# EasyEDA Pro project CALU_BMS_V1.3.0.0.epro, board PCB4
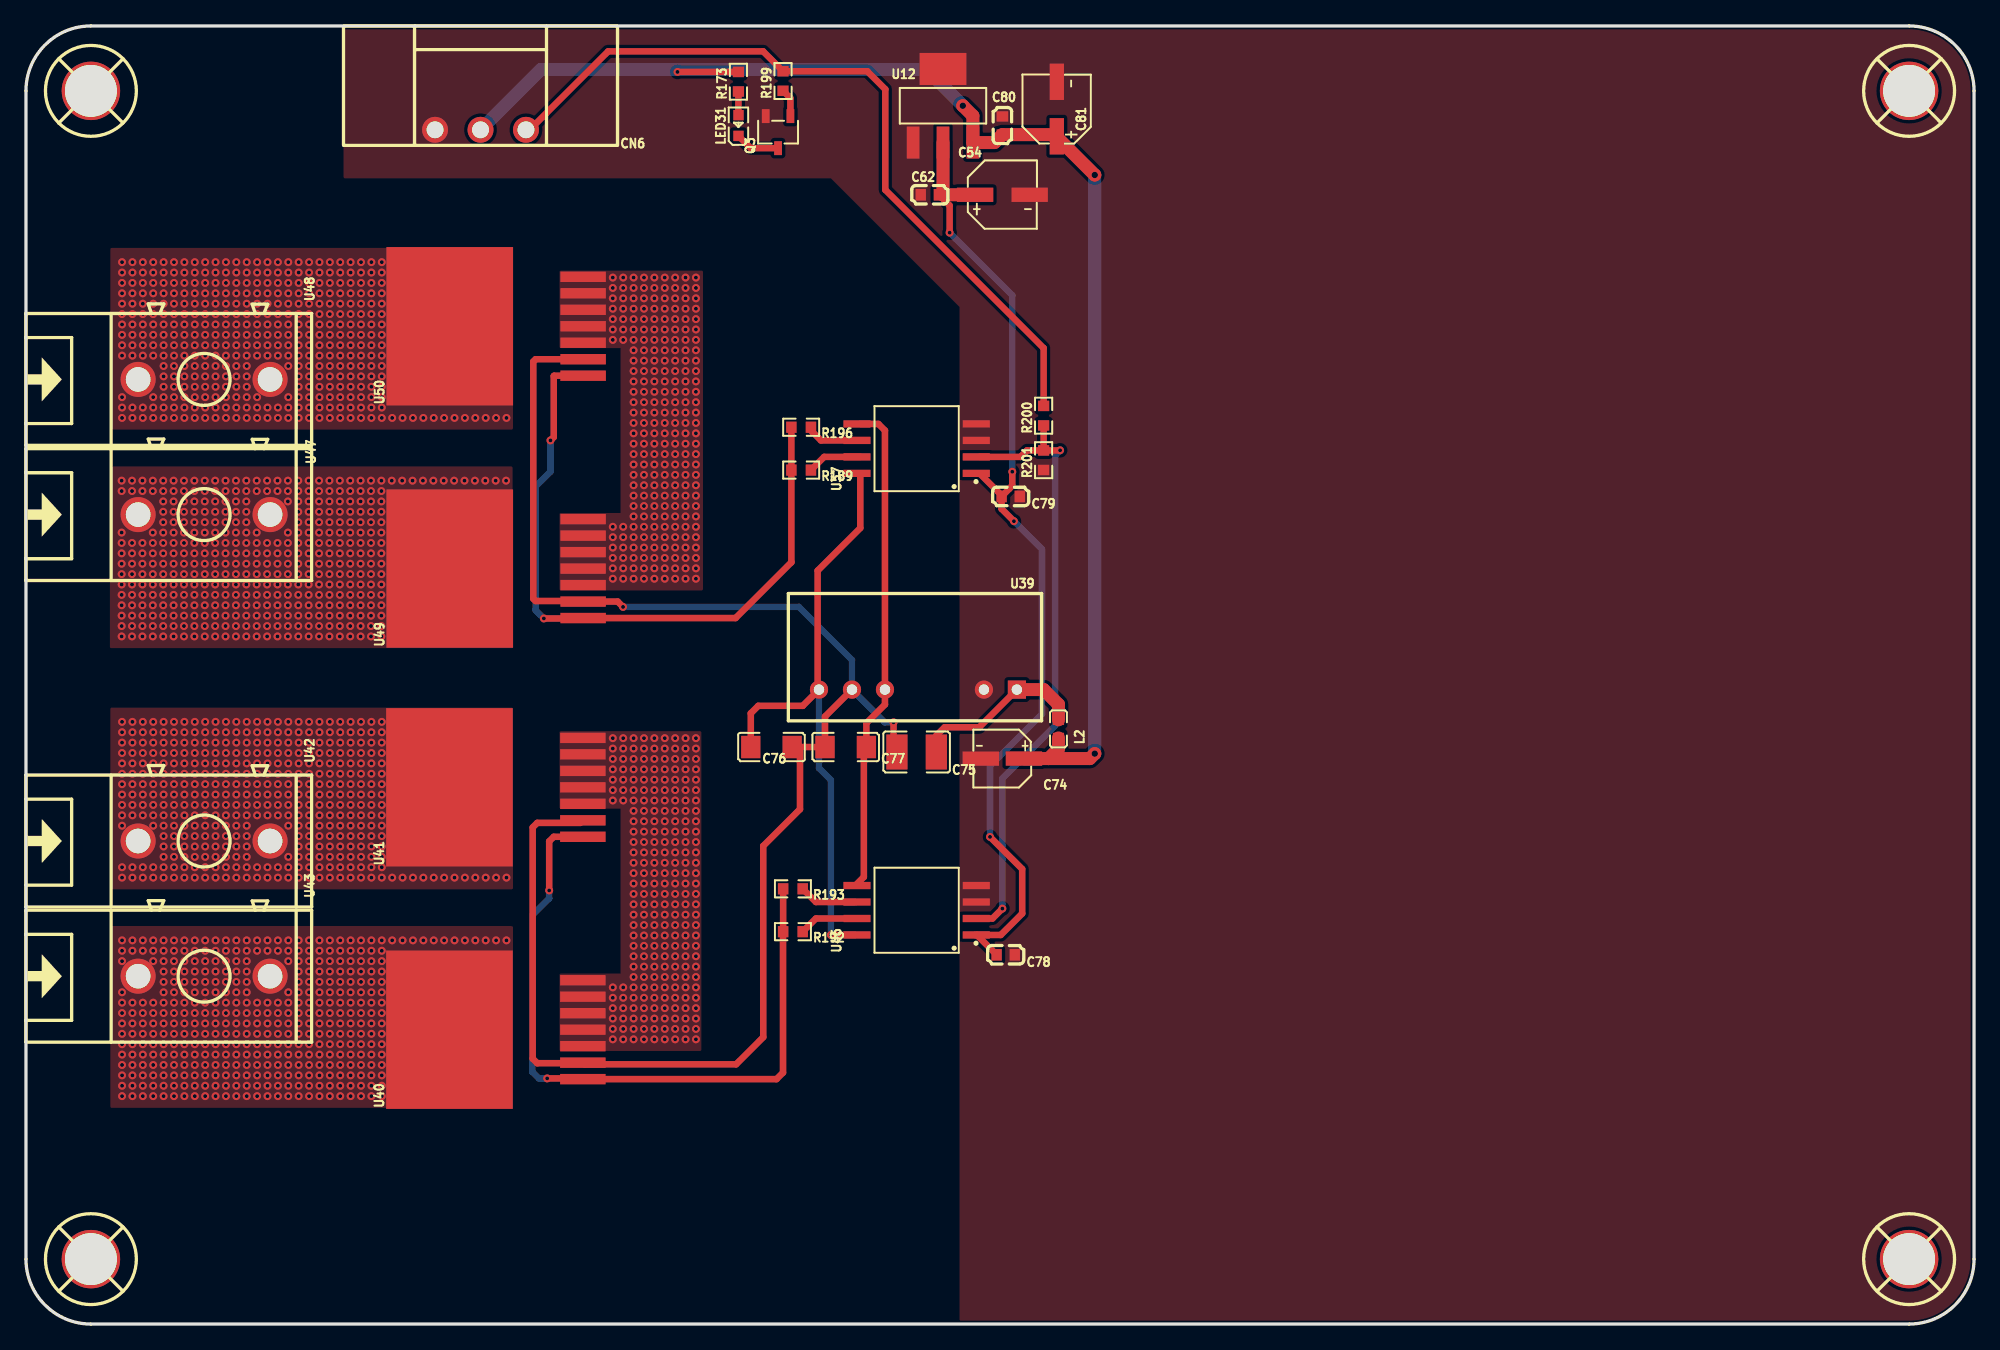
[diagram p15: board, top side]
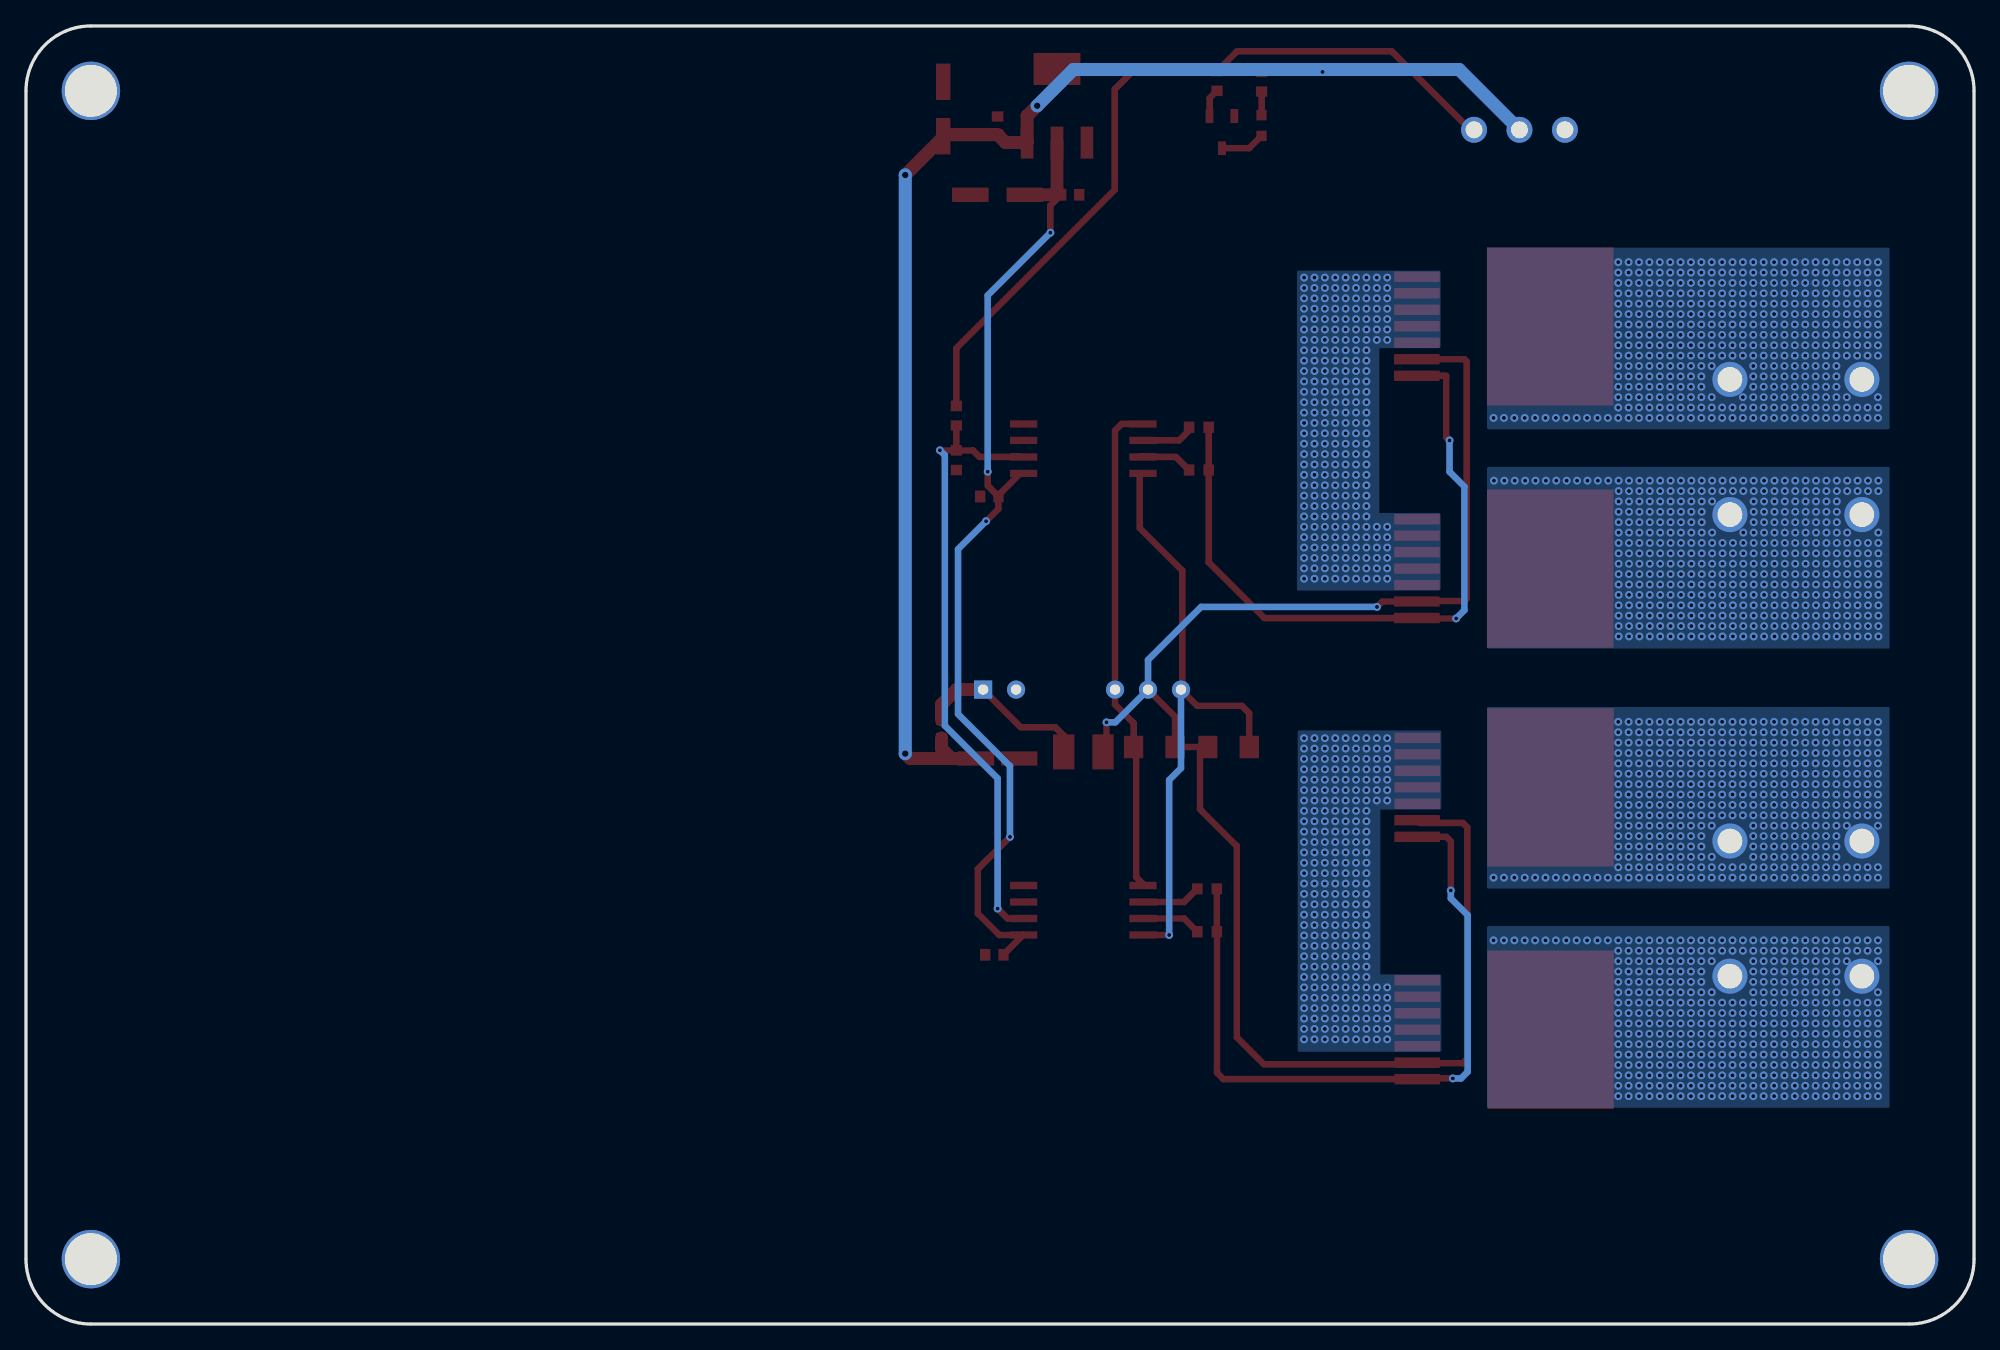
[diagram p16: board, bottom side, seen from below]

Outline 150 x 100 mm; copper layers: Top Layer, Bottom Layer. Coordinates in mm from the lower left corner of the outline.
Outline path: 0,95 0,5 arc(1.46,1.46) 5,0 145,0 arc(148.54,1.46) 150,5 150,95 arc(148.54,98.54) 145,100 5,100 arc(1.46,98.54) 0,95
Stack: Top Layer 0.035mm / Dielectric1 1.51mm FR4 er 4.5 / Bottom Layer 0.035mm

## Design rules (mm)
template: Custom Config
spacing copperThickness1oz (default): track to track 0.102, other pairs 0.152 to 0.3
spacing copperThickness2oz: track to track 0.203, other pairs 0.152 to 0.3
track width copperThickness1oz (default): min 0.127, default 0.254, max 2.54
track width copperThickness2oz: min 0.203, default 0.254, max 2.54
differential pair differentialPair (default): width min 0.127, default 0.254, max 2.54; gap min 0.152, default 0.152
via viaSize (default): diameter min 0.5, default 0.61, max 10; hole min 0.3, default 0.305, max 6.3

## Placement (name value [footprint] x y rotation side)
C54  22uF  [CAP-SMD_BD5.0-L5.3-W5.3-LS6.0-FD]  75.18 87 0 top
C62  100nF  [C0603]  69.6 87 0 top
C74  10uF  [CAP-SMD_BD4.0-L4.3-W4.3-FD]  75.18 43.56 180 top
C75  470pF  [C1210]  68.58 44.07 180 top
C76  4.7uF  [C1206]  57.4 44.45 180 top
C77  4.7uF  [C1206]  63.12 44.45 180 top
C78  100nF  [C0603]  75.44 28.45 180 top
C79  100nF  [C0603]  75.82 63.75 180 top
C80  100nF  [C0603]  75.18 92.33 270 top
C81  22uF  [CAP-SMD_BD5.0-L5.3-W5.3-LS6.0-FD]  79.38 93.6 90 top
CN6  INPUT  [CONN-TH_3P-P3.50_MAX_MX15EDGRM-3.5-GN01-03P-CU-A]  35 92 180 top
L2  10uH  [L0603]  79.5 45.85 90 top
LED31  ORH-B36G  [LED0603-RD]  54.86 92.33 90 top
Q3  S8050  [SOT-23-3_L2.9-W1.6-P1.90-LS2.8-BR]  57.91 91.82 90 top
R173  4.7kΩ  [R0603]  54.86 95.7 90 top
R189  10Ω  [R0603]  59.69 65.79 180 top
R192  10Ω  [R0603]  59.06 30.23 180 top
R193  10Ω  [R0603]  59.06 33.53 180 top
R196  10Ω  [R0603]  59.69 69.09 180 top
R199  10kΩ  [R0603]  58.29 95.76 90 top
R200  1kΩ  [R0603]  78.36 69.98 90 top
R201  2.7kΩ  [R0603]  78.36 66.55 90 top
SCREW1  -  [Screw-Hole-M4]  5 5 0 top
SCREW2  -  [Screw-Hole-M4]  145 5 0 top
SCREW3  -  [Screw-Hole-M4]  145 95 0 top
SCREW4  -  [Screw-Hole-M4]  5 95 0 top
U12  AMS1117-3.3  [SOT-223-4_L6.5-W3.5-P2.30-LS7.0-BR]  70.61 93.85 270 top
U37  1ED3121MU12H  [PG-DSO-8_L7.5-W6.4-P1.27-LS10.3-BL]  68.58 67.44 90 top
U39  50kHz  [PWRM-TH_5P-L19.5-W9.8_YLPTEC_RXXP2XX]  68.68 48.88 180 top
U40  SCT040H120G3AG  [H2PAK-7_L10.4-W10.0-P1.27-LS15.0-BL]  37.74 22.68 90 top
U41  SCT040H120G3AG  [H2PAK-7_L10.4-W10.0-P1.27-LS15.0-BL]  37.74 41.35 90 top
U42  INV+  [CONN-TH_JILN_JL136HT-101601G01]  13.72 37.21 270 top
U43  BAT+  [CONN-TH_JILN_JL136HT-101601G01]  13.72 26.8 270 top
U46  1ED3121MU12H  [PG-DSO-8_L7.5-W6.4-P1.27-LS10.3-BL]  68.58 31.88 90 top
U47  BAT-  [CONN-TH_JILN_JL136HT-101601G01]  13.72 62.36 270 top
U48  INV-  [CONN-TH_JILN_JL136HT-101601G01]  13.72 72.77 270 top
U49  SCT040H120G3AG  [H2PAK-7_L10.4-W10.0-P1.27-LS15.0-BL]  37.77 58.2 90 top
U50  SCT040H120G3AG  [H2PAK-7_L10.4-W10.0-P1.27-LS15.0-BL]  37.77 76.87 90 top

## Footprints (pads in the part's own frame, mm; a bottom-side part is the same pattern mirrored in y, then rotated)
C0603
  rect 0.8x0.9 smd: 1(-0.7,0) 2(0.7,0)
C1206
  rect 1.485x1.728 smd: 1(-1.593,0) 2(1.593,0)
C1210
  rect 1.635x2.7 smd: 1(-1.518,0) 2(1.518,0)
CAP-SMD_BD4.0-L4.3-W4.3-FD
  rect 2.8x1.1 smd: 1(-1.661,0) 2(1.661,0)
CAP-SMD_BD5.0-L5.3-W5.3-LS6.0-FD
  rect 2.8x1.1 smd: 1(-2.1,0) 2(2.1,0)
CONN-TH_3P-P3.50_MAX_MX15EDGRM-3.5-GN01-03P-CU-A
  round 2 hole 1.3: 1(-3.5,0) 2(0,0) 3(3.5,0)
CONN-TH_JILN_JL136HT-101601G01
  round 2.7 hole 1.9: 1(0,-5.08) 2(0,5.08)
H2PAK-7_L10.4-W10.0-P1.27-LS15.0-BL
  rect 0.8x3.5 smd: 1(-3.81,-5.135) 2(-2.54,-5.135) 3(-1.27,-5.135) 4(0,-5.135) 5(1.27,-5.135) 6(2.54,-5.135) 7(3.81,-5.135)
  rect 12.2x9.75 smd: 8(0,5.135)
L0603
  rect 0.8x0.864 smd: 1(-0.7,0) 2(0.7,0)
LED0603-RD
  rect 0.8x0.8 smd: 1(-0.799,0) 2(0.799,0)
PG-DSO-8_L7.5-W6.4-P1.27-LS10.3-BL
  rect 0.56x2.086 smd: 1(-1.905,-4.593) 2(-0.635,-4.593) 3(0.635,-4.593) 4(1.905,-4.593) 5(1.905,4.593) 6(0.635,4.593) 7(-0.635,4.593) 8(-1.905,4.593)
PWRM-TH_5P-L19.5-W9.8_YLPTEC_RXXP2XX
  rect 1.4x1.4 hole 0.8: 1(-7.62,0)
  round 1.4 hole 0.8: 2(-5.08,0) 5(2.54,0) 6(5.08,0) 7(7.62,0)
R0603
  rect 0.806x0.864 smd: 1(-0.753,0) 2(0.753,0)
Screw-Hole-M4
  round 4.5 hole 4: 1(0,0)
SOT-23-3_L2.9-W1.6-P1.90-LS2.8-BR
  rect 1.07x0.6 smd: 1(1.235,-0.95) 2(1.235,0.95) 3(-1.235,0)
SOT-223-4_L6.5-W3.5-P2.30-LS7.0-BR
  rect 2.47x0.98 smd: 1(2.835,-2.3) 2(2.835,0) 3(2.835,2.3)
  rect 2.47x3.6 smd: 4(-2.835,0)

## Nets
As in the schematic.

Pads without a net: SCREW1 1; SCREW2 1; SCREW3 1; SCREW4 1

## Via types
v1: diameter 1, hole 0.5, Top Layer to Bottom Layer, 3 vias
v2: diameter 0.61, hole 0.305, Top Layer to Bottom Layer, 2089 vias

## Routing (per net, layer and track width the routed paths; a pad name or vN(x,y) marks a point on that pad's centre or on a via; arc(x,y) is an arc through that point)
+12V: length 111.4
  Top Layer w0.5: R173.2 v2(50.17,96.46)
  Top Layer w1: v1(82.3,88.52) 79.38,91.44 C81.1 79.25,91.63 C80.2 74.57,91.02 U12.3 72.91,93.08 v1(72.14,93.85) ; 78.74,43.56 79.5,44.32 79.5,45.15 ; 78.74,43.56 C74.1 ; 78.74,43.56 81.91,43.56 v1(82.3,43.94)
  Bottom Layer w0.5: v2(50.17,96.46) 49.98,96.65
  Bottom Layer w1: v1(72.14,93.85) 69.34,96.65 39.65,96.65 CN6.2 ; v1(82.3,43.94) v1(82.3,88.52)
+15V_ISO: length 47.8
  Top Layer w0.5: 63.86,29.97 v2(61.98,29.97) ; 64.24,65.53 64.24,61.32 60.96,58.04 60.96,48.98 U39.7 59.81,47.62 56.39,47.62 55.81,47.05 C76.2
  Bottom Layer w0.5: U39.7 61.06,42.82 61.98,41.91 v2(61.98,29.97)
-9V_ISO: length 38.3
  Top Layer w0.5: 63.86,33.78 64.52,34.44 64.52,44.7 ; C77.1 64.71,46.3 66.14,47.73 U39.5 66.14,68.83 65.63,69.34 64.24,69.34
GND_ISO: length 129.9
  Top Layer w0.5: 59.22,44.45 C77.2 61.53,46.8 U39.6 ; 59.22,44.45 C76.1 ; 59.22,44.45 59.6,44.07 59.6,39.66 56.77,36.83 56.77,22.1 54.68,20.01 43.01,20.01 U40.2 42.84,20.09 39.37,20.09 39.02,20.45 39.02,38.25 39.37,38.61 42.68,38.61 U41.2 ; U50.2 39.24,74.33 39.06,74.15 39.06,55.88 39.24,55.7 42.86,55.7 U49.2 45.56,55.66 v2(45.97,55.25) ; 67.56,44.2 66.8,44.96 v2(66.8,46.36)
  Bottom Layer w0.5: v2(66.8,46.36) 66.12,46.36 U39.6 63.6,51.16 59.52,55.25 v2(45.97,55.25)
VCC: length 77.5
  Top Layer w0.5: v2(76.07,61.85) 75.12,62.8 C79.2 ; 73.43,65.53 75.12,63.84 C79.2 ; C79.2 75.72,64.35 75.72,64.37 75.95,64.6 v2(75.95,65.66) ; v2(74.23,37.53) 76.71,35.05 76.71,31.62 75.06,29.97 73.21,29.97 ; 73.21,29.97 73.05,29.97 ; 73.21,29.97 C78.2 ; v2(71.12,84.07) 71.12,86.17 C62.2
  Top Layer w1: C54.1 70.63,87 70.61,87.01 U12.2
  Bottom Layer w0.5: v2(76.07,61.85) 78.23,59.69 78.23,46.99 74.23,42.99 v2(74.23,37.53) ; v2(75.95,65.66) 75.95,79.25 v2(71.12,84.07)
SW_0: length 60.8
  Top Layer w0.5: R200.2 78.36,75.18 66.17,87.38 66.17,95.12 64.78,96.51 R199.2 56.76,98.04 44.83,98.04 38.79,92 CN6.1
SW_0_LVL: length 47.9
  Top Layer w0.5: v2(75.18,32) 74.42,31.24 73.05,31.24 ; R201.2 79.62,67.3 v2(79.63,67.31) ; R201.2 77.08,67.3 76.58,66.8 73.43,66.8 ; R201.2 R200.1
  Bottom Layer w0.5: v2(75.18,32) 75.18,42.04 79.25,46.1 79.25,66.93 v2(79.63,67.31)
$1N561: length 4.2
  Top Layer w0.5: R189.1 61.46,66.8 64.24,66.8
$1N564: length 4.4
  Top Layer w0.5: R196.1 60.44,68.84 61.21,68.07 64.24,68.07
$1N567: length 53
  Top Layer w0.5: v2(40.39,68.07) 40.64,68.33 40.64,73.03 40.67,73.06 U50.1 ; v2(39.88,54.36) 42.87,54.36 U49.1 54.64,54.39 58.94,58.68 R189.2 R196.2
  Bottom Layer w0.5: v2(39.88,54.36) 39.24,54.99 39.24,64.52 40.39,65.66 v2(40.39,68.07)
$1N591:
  vias: v2(45.19,45.13) v2(45.19,44.33) v2(45.19,43.53) v2(45.19,42.73) v2(45.19,41.93) v2(45.19,41.13) v2(45.19,40.33) v2(45.19,25.93) v2(45.19,25.13) v2(45.19,24.33) v2(45.19,23.53) v2(45.19,22.73) v2(45.19,21.93) v2(45.99,45.13) v2(45.99,44.33) v2(45.99,43.53) v2(45.99,42.73) v2(45.99,41.93) v2(45.99,41.13) v2(45.99,40.33) v2(45.99,25.93) v2(45.99,25.13) v2(45.99,24.33) v2(45.99,23.53) v2(45.99,22.73) v2(45.99,21.93) v2(46.79,45.13) v2(46.79,44.33) v2(46.79,43.53) v2(46.79,42.73) v2(46.79,41.93) v2(46.79,41.13) v2(46.79,40.33) v2(46.79,39.53) v2(46.79,38.73) v2(46.79,37.93) v2(46.79,37.13) v2(46.79,36.33) v2(46.79,35.53) v2(46.79,34.73) v2(46.79,33.93) v2(46.79,33.13) v2(46.79,32.33) v2(46.79,31.53) v2(46.79,30.73) v2(46.79,29.93) v2(46.79,29.13) v2(46.79,28.33) v2(46.79,27.53) v2(46.79,26.73) v2(46.79,25.93) v2(46.79,25.13) v2(46.79,24.33) v2(46.79,23.53) v2(46.79,22.73) v2(46.79,21.93) v2(47.59,45.13) v2(47.59,44.33) v2(47.59,43.53) v2(47.59,42.73) v2(47.59,41.93) v2(47.59,41.13) v2(47.59,40.33) v2(47.59,39.53) v2(47.59,38.73) v2(47.59,37.93) v2(47.59,37.13) v2(47.59,36.33) v2(47.59,35.53) v2(47.59,34.73) v2(47.59,33.93) v2(47.59,33.13) v2(47.59,32.33) v2(47.59,31.53) v2(47.59,30.73) v2(47.59,29.93) v2(47.59,29.13) v2(47.59,28.33) v2(47.59,27.53) v2(47.59,26.73) v2(47.59,25.93) v2(47.59,25.13) v2(47.59,24.33) v2(47.59,23.53) v2(47.59,22.73) v2(47.59,21.93) v2(48.39,45.13) v2(48.39,44.33) v2(48.39,43.53) v2(48.39,42.73) v2(48.39,41.93) v2(48.39,41.13) v2(48.39,40.33) v2(48.39,39.53) v2(48.39,38.73) v2(48.39,37.93) v2(48.39,37.13) v2(48.39,36.33) v2(48.39,35.53) v2(48.39,34.73) v2(48.39,33.93) v2(48.39,33.13) v2(48.39,32.33) v2(48.39,31.53) v2(48.39,30.73) v2(48.39,29.93) v2(48.39,29.13) v2(48.39,28.33) v2(48.39,27.53) v2(48.39,26.73) v2(48.39,25.93) v2(48.39,25.13) v2(48.39,24.33) v2(48.39,23.53) v2(48.39,22.73) v2(48.39,21.93) v2(49.19,45.13) v2(49.19,44.33) v2(49.19,43.53) v2(49.19,42.73) v2(49.19,41.93) v2(49.19,41.13) v2(49.19,40.33) v2(49.19,39.53) v2(49.19,38.73) v2(49.19,37.93) v2(49.19,37.13) v2(49.19,36.33) v2(49.19,35.53) v2(49.19,34.73) v2(49.19,33.93) v2(49.19,33.13) v2(49.19,32.33) v2(49.19,31.53) v2(49.19,30.73) v2(49.19,29.93) v2(49.19,29.13) v2(49.19,28.33) v2(49.19,27.53) v2(49.19,26.73) v2(49.19,25.93) v2(49.19,25.13) v2(49.19,24.33) v2(49.19,23.53) v2(49.19,22.73) v2(49.19,21.93) v2(49.99,45.13) v2(49.99,44.33) v2(49.99,43.53) v2(49.99,42.73) v2(49.99,41.93) v2(49.99,41.13) v2(49.99,40.33) v2(49.99,39.53) v2(49.99,38.73) v2(49.99,37.93) v2(49.99,37.13) v2(49.99,36.33) v2(49.99,35.53) v2(49.99,34.73) v2(49.99,33.93) v2(49.99,33.13) v2(49.99,32.33) v2(49.99,31.53) v2(49.99,30.73) v2(49.99,29.93) v2(49.99,29.13) v2(49.99,28.33) v2(49.99,27.53) v2(49.99,26.73) v2(49.99,25.93) v2(49.99,25.13) v2(49.99,24.33) v2(49.99,23.53) v2(49.99,22.73) v2(49.99,21.93) v2(50.79,45.13) v2(50.79,44.33) v2(50.79,43.53) v2(50.79,42.73) v2(50.79,41.93) v2(50.79,41.13) v2(50.79,40.33) v2(50.79,39.53) v2(50.79,38.73) v2(50.79,37.93) v2(50.79,37.13) v2(50.79,36.33) v2(50.79,35.53) v2(50.79,34.73) v2(50.79,33.93) v2(50.79,33.13) v2(50.79,32.33) v2(50.79,31.53) v2(50.79,30.73) v2(50.79,29.93) v2(50.79,29.13) v2(50.79,28.33) v2(50.79,27.53) v2(50.79,26.73) v2(50.79,25.93) v2(50.79,25.13) v2(50.79,24.33) v2(50.79,23.53) v2(50.79,22.73) v2(50.79,21.93) v2(51.59,45.13) v2(51.59,44.33) v2(51.59,43.53) v2(51.59,42.73) v2(51.59,41.93) v2(51.59,41.13) v2(51.59,40.33) v2(51.59,39.53) v2(51.59,38.73) v2(51.59,37.93) v2(51.59,37.13) v2(51.59,36.33) v2(51.59,35.53) v2(51.59,34.73) v2(51.59,33.93) v2(51.59,33.13) v2(51.59,32.33) v2(51.59,31.53) v2(51.59,30.73) v2(51.59,29.93) v2(51.59,29.13) v2(51.59,28.33) v2(51.59,27.53) v2(51.59,26.73) v2(51.59,25.93) v2(51.59,25.13) v2(51.59,24.33) v2(51.59,23.53) v2(51.59,22.73) v2(51.59,21.93)
$1N980: length 13.8
  Top Layer w0.5: U39.1 73.4,45.97 70.74,45.97 70.1,45.33 C75.1
  Top Layer w1: U39.1 78.36,48.88 79.5,47.73 L2.2
$1N1089: length 1.8
  Top Layer w0.5: 54.86,94.95 54.86,93.13 LED31.2
$1N1249: length 3.4
  Top Layer w0.5: Q3.3 55.81,90.59 LED31.1
$1N1560: length 4.5
  Top Layer w0.5: 63.86,31.24 60.82,31.24 R192.1
$1N1563: length 4.5
  Top Layer w0.5: 63.86,32.51 60.82,32.51 R193.1
$1N1566: length 54.9
  Top Layer w0.5: R193.2 R192.2 58.29,30.22 58.29,19.37 57.79,18.87 U40.1 42.82,18.92 v2(40.13,18.92) ; v2(40.29,33.4) 40.29,37.18 40.64,37.54 U41.1
  Bottom Layer w0.5: v2(40.29,33.4) 40.29,32.79 38.99,31.5 38.99,19.43 39.5,18.92 v2(40.13,18.92)
$1N1634:
  vias: v2(7.4,29.56) v2(7.4,28.76) v2(7.4,27.96) v2(7.4,25.56) v2(7.4,24.76) v2(7.4,23.96) v2(7.4,23.16) v2(7.4,22.36) v2(7.4,21.56) v2(7.4,20.76) v2(7.4,19.96) v2(7.4,19.16) v2(7.4,18.36) v2(7.4,17.56) v2(8.2,29.56) v2(8.2,28.76) v2(8.2,24.76) v2(8.2,23.96) v2(8.2,23.16) v2(8.2,22.36) v2(8.2,21.56) v2(8.2,20.76) v2(8.2,19.96) v2(8.2,19.16) v2(8.2,18.36) v2(8.2,17.56) v2(9,29.56) v2(9,28.76) v2(9,24.76) v2(9,23.96) v2(9,23.16) v2(9,22.36) v2(9,21.56) v2(9,20.76) v2(9,19.96) v2(9,19.16) v2(9,18.36) v2(9,17.56) v2(9.8,29.56) v2(9.8,28.76) v2(9.8,27.96) v2(9.8,24.76) v2(9.8,23.96) v2(9.8,23.16) v2(9.8,22.36) v2(9.8,21.56) v2(9.8,20.76) v2(9.8,19.96) v2(9.8,19.16) v2(9.8,18.36) v2(9.8,17.56) v2(10.6,29.56) v2(10.6,28.76) v2(10.6,27.96) v2(10.6,27.16) v2(10.6,26.36) v2(10.6,25.56) v2(10.6,24.76) v2(10.6,23.96) v2(10.6,23.16) v2(10.6,22.36) v2(10.6,21.56) v2(10.6,20.76) v2(10.6,19.96) v2(10.6,19.16) v2(10.6,18.36) v2(10.6,17.56) v2(11.4,29.56) v2(11.4,28.76) v2(11.4,27.96) v2(11.4,27.16) v2(11.4,26.36) v2(11.4,25.56) v2(11.4,24.76) v2(11.4,23.96) v2(11.4,23.16) v2(11.4,22.36) v2(11.4,21.56) v2(11.4,20.76) v2(11.4,19.96) v2(11.4,19.16) v2(11.4,18.36) v2(11.4,17.56) v2(12.2,29.56) v2(12.2,28.76) v2(12.2,27.96) v2(12.2,27.16) v2(12.2,26.36) v2(12.2,25.56) v2(12.2,24.76) v2(12.2,23.96) v2(12.2,23.16) v2(12.2,22.36) v2(12.2,21.56) v2(12.2,20.76) v2(12.2,19.96) v2(12.2,19.16) v2(12.2,18.36) v2(12.2,17.56) v2(13,29.56) v2(13,28.76) v2(13,27.96) v2(13,27.16) v2(13,26.36) v2(13,25.56) v2(13,24.76) v2(13,23.96) v2(13,23.16) v2(13,22.36) v2(13,21.56) v2(13,20.76) v2(13,19.96) v2(13,19.16) v2(13,18.36) v2(13,17.56) v2(13.8,29.56) v2(13.8,28.76) v2(13.8,27.96) v2(13.8,27.16) v2(13.8,26.36) v2(13.8,25.56) v2(13.8,24.76) v2(13.8,23.96) v2(13.8,23.16) v2(13.8,22.36) v2(13.8,21.56) v2(13.8,20.76) v2(13.8,19.96) v2(13.8,19.16) v2(13.8,18.36) v2(13.8,17.56) v2(14.6,29.56) v2(14.6,28.76) v2(14.6,27.96) v2(14.6,27.16) v2(14.6,26.36) v2(14.6,25.56) v2(14.6,24.76) v2(14.6,23.96) v2(14.6,23.16) v2(14.6,22.36) v2(14.6,21.56) v2(14.6,20.76) v2(14.6,19.96) v2(14.6,19.16) v2(14.6,18.36) v2(14.6,17.56) v2(15.4,29.56) v2(15.4,28.76) v2(15.4,27.96) v2(15.4,27.16) v2(15.4,26.36) v2(15.4,25.56) v2(15.4,24.76) v2(15.4,23.96) v2(15.4,23.16) v2(15.4,22.36) v2(15.4,21.56) v2(15.4,20.76) v2(15.4,19.96) v2(15.4,19.16) v2(15.4,18.36) v2(15.4,17.56) v2(16.2,29.56) v2(16.2,28.76) v2(16.2,27.96) v2(16.2,27.16) v2(16.2,26.36) v2(16.2,25.56) v2(16.2,24.76) v2(16.2,23.96) v2(16.2,23.16) v2(16.2,22.36) v2(16.2,21.56) v2(16.2,20.76) v2(16.2,19.96) v2(16.2,19.16) v2(16.2,18.36) v2(16.2,17.56) v2(17,29.56) v2(17,28.76) v2(17,27.96) v2(17,27.16) v2(17,26.36) v2(17,25.56) v2(17,24.76) v2(17,23.96) v2(17,23.16) v2(17,22.36) v2(17,21.56) v2(17,20.76) v2(17,19.96) v2(17,19.16) v2(17,18.36) v2(17,17.56) v2(17.8,29.56) v2(17.8,28.76) v2(17.8,24.76) v2(17.8,23.96) v2(17.8,23.16) v2(17.8,22.36) v2(17.8,21.56) v2(17.8,20.76) v2(17.8,19.96) v2(17.8,19.16) v2(17.8,18.36) v2(17.8,17.56) v2(18.6,29.56) v2(18.6,28.76) v2(18.6,24.76) v2(18.6,23.96) v2(18.6,23.16) v2(18.6,22.36) v2(18.6,21.56) v2(18.6,20.76) v2(18.6,19.96) v2(18.6,19.16) v2(18.6,18.36) v2(18.6,17.56) v2(19.4,29.56) v2(19.4,28.76) v2(19.4,24.76) v2(19.4,23.96) v2(19.4,23.16) v2(19.4,22.36) v2(19.4,21.56) v2(19.4,20.76) v2(19.4,19.96) v2(19.4,19.16) v2(19.4,18.36) v2(19.4,17.56) v2(20.2,29.56) v2(20.2,28.76) v2(20.2,27.96) v2(20.2,25.56) v2(20.2,24.76) v2(20.2,23.96) v2(20.2,23.16) v2(20.2,22.36) v2(20.2,21.56) v2(20.2,20.76) v2(20.2,19.96) v2(20.2,19.16) v2(20.2,18.36) v2(20.2,17.56) v2(21,29.56) v2(21,28.76) v2(21,27.96) v2(21,27.16) v2(21,26.36) v2(21,25.56) v2(21,24.76) v2(21,23.96) v2(21,23.16) v2(21,22.36) v2(21,21.56) v2(21,20.76) v2(21,19.96) v2(21,19.16) v2(21,18.36) v2(21,17.56) v2(21.8,29.56) v2(21.8,28.76) v2(21.8,27.96) v2(21.8,27.16) v2(21.8,26.36) v2(21.8,25.56) v2(21.8,24.76) v2(21.8,23.96) v2(21.8,23.16) v2(21.8,22.36) v2(21.8,21.56) v2(21.8,20.76) v2(21.8,19.96) v2(21.8,19.16) v2(21.8,18.36) v2(21.8,17.56) v2(22.6,29.56) v2(22.6,28.76) v2(22.6,27.96) v2(22.6,27.16) v2(22.6,26.36) v2(22.6,25.56) v2(22.6,24.76) v2(22.6,23.96) v2(22.6,23.16) v2(22.6,22.36) v2(22.6,21.56) v2(22.6,20.76) v2(22.6,19.96) v2(22.6,19.16) v2(22.6,18.36) v2(22.6,17.56) v2(23.4,29.56) v2(23.4,28.76) v2(23.4,27.96) v2(23.4,27.16) v2(23.4,26.36) v2(23.4,25.56) v2(23.4,24.76) v2(23.4,23.96) v2(23.4,23.16) v2(23.4,22.36) v2(23.4,21.56) v2(23.4,20.76) v2(23.4,19.96) v2(23.4,19.16) v2(23.4,18.36) v2(23.4,17.56) v2(24.2,29.56) v2(24.2,28.76) v2(24.2,27.96) v2(24.2,27.16) v2(24.2,26.36) v2(24.2,25.56) v2(24.2,24.76) v2(24.2,23.96) v2(24.2,23.16) v2(24.2,22.36) v2(24.2,21.56) v2(24.2,20.76) v2(24.2,19.96) v2(24.2,19.16) v2(24.2,18.36) v2(24.2,17.56) v2(25,29.56) v2(25,28.76) v2(25,27.96) v2(25,27.16) v2(25,26.36) v2(25,25.56) v2(25,24.76) v2(25,23.96) v2(25,23.16) v2(25,22.36) v2(25,21.56) v2(25,20.76) v2(25,19.96) v2(25,19.16) v2(25,18.36) v2(25,17.56) v2(25.8,29.56) v2(25.8,28.76) v2(25.8,27.96) v2(25.8,27.16) v2(25.8,26.36) v2(25.8,25.56) v2(25.8,24.76) v2(25.8,23.96) v2(25.8,23.16) v2(25.8,22.36) v2(25.8,21.56) v2(25.8,20.76) v2(25.8,19.96) v2(25.8,19.16) v2(25.8,18.36) v2(25.8,17.56) v2(26.6,29.56) v2(26.6,28.76) v2(26.6,27.96) v2(26.6,27.16) v2(26.6,26.36) v2(26.6,25.56) v2(26.6,24.76) v2(26.6,23.96) v2(26.6,23.16) v2(26.6,22.36) v2(26.6,21.56) v2(26.6,20.76) v2(26.6,19.96) v2(26.6,19.16) v2(26.6,18.36) v2(26.6,17.56) v2(27.4,29.56) v2(27.4,28.76) v2(27.4,27.96) v2(27.4,27.16) v2(27.4,26.36) v2(27.4,25.56) v2(27.4,24.76) v2(27.4,23.96) v2(27.4,23.16) v2(27.4,22.36) v2(27.4,21.56) v2(27.4,20.76) v2(27.4,19.96) v2(27.4,19.16) v2(27.4,18.36) v2(27.4,17.56) v2(28.2,29.56) v2(29,29.56) v2(29.8,29.56) v2(30.6,29.56) v2(31.4,29.56) v2(32.2,29.56) v2(33,29.56) v2(33.8,29.56) v2(34.6,29.56) v2(35.4,29.56) v2(36.2,29.56) v2(37,29.56)
$1N1649:
  vias: v2(7.4,46.39) v2(7.4,45.59) v2(7.4,44.79) v2(7.4,43.99) v2(7.4,43.19) v2(7.4,42.39) v2(7.4,41.59) v2(7.4,40.79) v2(7.4,39.99) v2(7.4,39.19) v2(7.4,38.39) v2(7.4,35.19) v2(7.4,34.39) v2(8.2,46.39) v2(8.2,45.59) v2(8.2,44.79) v2(8.2,43.99) v2(8.2,43.19) v2(8.2,42.39) v2(8.2,41.59) v2(8.2,40.79) v2(8.2,39.99) v2(8.2,39.19) v2(8.2,35.19) v2(8.2,34.39) v2(9,46.39) v2(9,45.59) v2(9,44.79) v2(9,43.99) v2(9,43.19) v2(9,42.39) v2(9,41.59) v2(9,40.79) v2(9,39.99) v2(9,39.19) v2(9,35.19) v2(9,34.39) v2(9.8,46.39) v2(9.8,45.59) v2(9.8,44.79) v2(9.8,43.99) v2(9.8,43.19) v2(9.8,42.39) v2(9.8,41.59) v2(9.8,40.79) v2(9.8,39.99) v2(9.8,39.19) v2(9.8,38.39) v2(9.8,35.19) v2(9.8,34.39) v2(10.6,46.39) v2(10.6,45.59) v2(10.6,44.79) v2(10.6,43.99) v2(10.6,43.19) v2(10.6,42.39) v2(10.6,41.59) v2(10.6,40.79) v2(10.6,39.99) v2(10.6,39.19) v2(10.6,38.39) v2(10.6,37.59) v2(10.6,36.79) v2(10.6,35.99) v2(10.6,35.19) v2(10.6,34.39) v2(11.4,46.39) v2(11.4,45.59) v2(11.4,44.79) v2(11.4,43.99) v2(11.4,43.19) v2(11.4,42.39) v2(11.4,41.59) v2(11.4,40.79) v2(11.4,39.99) v2(11.4,39.19) v2(11.4,38.39) v2(11.4,37.59) v2(11.4,36.79) v2(11.4,35.99) v2(11.4,35.19) v2(11.4,34.39) v2(12.2,46.39) v2(12.2,45.59) v2(12.2,44.79) v2(12.2,43.99) v2(12.2,43.19) v2(12.2,42.39) v2(12.2,41.59) v2(12.2,40.79) v2(12.2,39.99) v2(12.2,39.19) v2(12.2,38.39) v2(12.2,37.59) v2(12.2,36.79) v2(12.2,35.99) v2(12.2,35.19) v2(12.2,34.39) v2(13,46.39) v2(13,45.59) v2(13,44.79) v2(13,43.99) v2(13,43.19) v2(13,42.39) v2(13,41.59) v2(13,40.79) v2(13,39.99) v2(13,39.19) v2(13,38.39) v2(13,37.59) v2(13,36.79) v2(13,35.99) v2(13,35.19) v2(13,34.39) v2(13.8,46.39) v2(13.8,45.59) v2(13.8,44.79) v2(13.8,43.99) v2(13.8,43.19) v2(13.8,42.39) v2(13.8,41.59) v2(13.8,40.79) v2(13.8,39.99) v2(13.8,39.19) v2(13.8,38.39) v2(13.8,37.59) v2(13.8,36.79) v2(13.8,35.99) v2(13.8,35.19) v2(13.8,34.39) v2(14.6,46.39) v2(14.6,45.59) v2(14.6,44.79) v2(14.6,43.99) v2(14.6,43.19) v2(14.6,42.39) v2(14.6,41.59) v2(14.6,40.79) v2(14.6,39.99) v2(14.6,39.19) v2(14.6,38.39) v2(14.6,37.59) v2(14.6,36.79) v2(14.6,35.99) v2(14.6,35.19) v2(14.6,34.39) v2(15.4,46.39) v2(15.4,45.59) v2(15.4,44.79) v2(15.4,43.99) v2(15.4,43.19) v2(15.4,42.39) v2(15.4,41.59) v2(15.4,40.79) v2(15.4,39.99) v2(15.4,39.19) v2(15.4,38.39) v2(15.4,37.59) v2(15.4,36.79) v2(15.4,35.99) v2(15.4,35.19) v2(15.4,34.39) v2(16.2,46.39) v2(16.2,45.59) v2(16.2,44.79) v2(16.2,43.99) v2(16.2,43.19) v2(16.2,42.39) v2(16.2,41.59) v2(16.2,40.79) v2(16.2,39.99) v2(16.2,39.19) v2(16.2,38.39) v2(16.2,37.59) v2(16.2,36.79) v2(16.2,35.99) v2(16.2,35.19) v2(16.2,34.39) v2(17,46.39) v2(17,45.59) v2(17,44.79) v2(17,43.99) v2(17,43.19) v2(17,42.39) v2(17,41.59) v2(17,40.79) v2(17,39.99) v2(17,39.19) v2(17,38.39) v2(17,37.59) v2(17,36.79) v2(17,35.99) v2(17,35.19) v2(17,34.39) v2(17.8,46.39) v2(17.8,45.59) v2(17.8,44.79) v2(17.8,43.99) v2(17.8,43.19) v2(17.8,42.39) v2(17.8,41.59) v2(17.8,40.79) v2(17.8,39.99) v2(17.8,39.19) v2(17.8,35.19) v2(17.8,34.39) v2(18.6,46.39) v2(18.6,45.59) v2(18.6,44.79) v2(18.6,43.99) v2(18.6,43.19) v2(18.6,42.39) v2(18.6,41.59) v2(18.6,40.79) v2(18.6,39.99) v2(18.6,39.19) v2(18.6,35.19) v2(18.6,34.39) v2(19.4,46.39) v2(19.4,45.59) v2(19.4,44.79) v2(19.4,43.99) v2(19.4,43.19) v2(19.4,42.39) v2(19.4,41.59) v2(19.4,40.79) v2(19.4,39.99) v2(19.4,39.19) v2(19.4,35.19) v2(19.4,34.39) v2(20.2,46.39) v2(20.2,45.59) v2(20.2,44.79) v2(20.2,43.99) v2(20.2,43.19) v2(20.2,42.39) v2(20.2,41.59) v2(20.2,40.79) v2(20.2,39.99) v2(20.2,39.19) v2(20.2,38.39) v2(20.2,35.99) v2(20.2,35.19) v2(20.2,34.39) v2(21,46.39) v2(21,45.59) v2(21,44.79) v2(21,43.99) v2(21,43.19) v2(21,42.39) v2(21,41.59) v2(21,40.79) v2(21,39.99) v2(21,39.19) v2(21,38.39) v2(21,37.59) v2(21,36.79) v2(21,35.99) v2(21,35.19) v2(21,34.39) v2(21.8,46.39) v2(21.8,45.59) v2(21.8,44.79) v2(21.8,43.99) v2(21.8,43.19) v2(21.8,42.39) v2(21.8,41.59) v2(21.8,40.79) v2(21.8,39.99) v2(21.8,39.19) v2(21.8,38.39) v2(21.8,37.59) v2(21.8,36.79) v2(21.8,35.99) v2(21.8,35.19) v2(21.8,34.39) v2(22.6,46.39) v2(22.6,45.59) v2(22.6,44.79) v2(22.6,43.99) v2(22.6,43.19) v2(22.6,42.39) v2(22.6,41.59) v2(22.6,40.79) v2(22.6,39.99) v2(22.6,39.19) v2(22.6,38.39) v2(22.6,37.59) v2(22.6,36.79) v2(22.6,35.99) v2(22.6,35.19) v2(22.6,34.39) v2(23.4,46.39) v2(23.4,45.59) v2(23.4,44.79) v2(23.4,43.99) v2(23.4,43.19) v2(23.4,42.39) v2(23.4,41.59) v2(23.4,40.79) v2(23.4,39.99) v2(23.4,39.19) v2(23.4,38.39) v2(23.4,37.59) v2(23.4,36.79) v2(23.4,35.99) v2(23.4,35.19) v2(23.4,34.39) v2(24.2,46.39) v2(24.2,45.59) v2(24.2,44.79) v2(24.2,43.99) v2(24.2,43.19) v2(24.2,42.39) v2(24.2,41.59) v2(24.2,40.79) v2(24.2,39.99) v2(24.2,39.19) v2(24.2,38.39) v2(24.2,37.59) v2(24.2,36.79) v2(24.2,35.99) v2(24.2,35.19) v2(24.2,34.39) v2(25,46.39) v2(25,45.59) v2(25,44.79) v2(25,43.99) v2(25,43.19) v2(25,42.39) v2(25,41.59) v2(25,40.79) v2(25,39.99) v2(25,39.19) v2(25,38.39) v2(25,37.59) v2(25,36.79) v2(25,35.99) v2(25,35.19) v2(25,34.39) v2(25.8,46.39) v2(25.8,45.59) v2(25.8,44.79) v2(25.8,43.99) v2(25.8,43.19) v2(25.8,42.39) v2(25.8,41.59) v2(25.8,40.79) v2(25.8,39.99) v2(25.8,39.19) v2(25.8,38.39) v2(25.8,37.59) v2(25.8,36.79) v2(25.8,35.99) v2(25.8,35.19) v2(25.8,34.39) v2(26.6,46.39) v2(26.6,45.59) v2(26.6,44.79) v2(26.6,43.99) v2(26.6,43.19) v2(26.6,42.39) v2(26.6,41.59) v2(26.6,40.79) v2(26.6,39.99) v2(26.6,39.19) v2(26.6,38.39) v2(26.6,37.59) v2(26.6,36.79) v2(26.6,35.99) v2(26.6,35.19) v2(26.6,34.39) v2(27.4,46.39) v2(27.4,45.59) v2(27.4,44.79) v2(27.4,43.99) v2(27.4,43.19) v2(27.4,42.39) v2(27.4,41.59) v2(27.4,40.79) v2(27.4,39.99) v2(27.4,39.19) v2(27.4,38.39) v2(27.4,37.59) v2(27.4,36.79) v2(27.4,35.99) v2(27.4,35.19) v2(27.4,34.39) v2(28.2,34.39) v2(29,34.39) v2(29.8,34.39) v2(30.6,34.39) v2(31.4,34.39) v2(32.2,34.39) v2(33,34.39) v2(33.8,34.39) v2(34.6,34.39) v2(35.4,34.39) v2(36.2,34.39) v2(37,34.39)
$1N1712:
  vias: v2(7.37,64.97) v2(7.37,64.17) v2(7.37,60.97) v2(7.37,60.17) v2(7.37,59.37) v2(7.37,58.57) v2(7.37,57.77) v2(7.37,56.97) v2(7.37,56.17) v2(7.37,55.37) v2(7.37,54.57) v2(7.37,53.77) v2(7.37,52.97) v2(8.17,64.97) v2(8.17,64.17) v2(8.17,60.17) v2(8.17,59.37) v2(8.17,58.57) v2(8.17,57.77) v2(8.17,56.97) v2(8.17,56.17) v2(8.17,55.37) v2(8.17,54.57) v2(8.17,53.77) v2(8.17,52.97) v2(8.97,64.97) v2(8.97,64.17) v2(8.97,60.17) v2(8.97,59.37) v2(8.97,58.57) v2(8.97,57.77) v2(8.97,56.97) v2(8.97,56.17) v2(8.97,55.37) v2(8.97,54.57) v2(8.97,53.77) v2(8.97,52.97) v2(9.77,64.97) v2(9.77,64.17) v2(9.77,60.97) v2(9.77,60.17) v2(9.77,59.37) v2(9.77,58.57) v2(9.77,57.77) v2(9.77,56.97) v2(9.77,56.17) v2(9.77,55.37) v2(9.77,54.57) v2(9.77,53.77) v2(9.77,52.97) v2(10.57,64.97) v2(10.57,64.17) v2(10.57,63.37) v2(10.57,62.57) v2(10.57,61.77) v2(10.57,60.97) v2(10.57,60.17) v2(10.57,59.37) v2(10.57,58.57) v2(10.57,57.77) v2(10.57,56.97) v2(10.57,56.17) v2(10.57,55.37) v2(10.57,54.57) v2(10.57,53.77) v2(10.57,52.97) v2(11.37,64.97) v2(11.37,64.17) v2(11.37,63.37) v2(11.37,62.57) v2(11.37,61.77) v2(11.37,60.97) v2(11.37,60.17) v2(11.37,59.37) v2(11.37,58.57) v2(11.37,57.77) v2(11.37,56.97) v2(11.37,56.17) v2(11.37,55.37) v2(11.37,54.57) v2(11.37,53.77) v2(11.37,52.97) v2(12.17,64.97) v2(12.17,64.17) v2(12.17,63.37) v2(12.17,62.57) v2(12.17,61.77) v2(12.17,60.97) v2(12.17,60.17) v2(12.17,59.37) v2(12.17,58.57) v2(12.17,57.77) v2(12.17,56.97) v2(12.17,56.17) v2(12.17,55.37) v2(12.17,54.57) v2(12.17,53.77) v2(12.17,52.97) v2(12.97,64.97) v2(12.97,64.17) v2(12.97,63.37) v2(12.97,62.57) v2(12.97,61.77) v2(12.97,60.97) v2(12.97,60.17) v2(12.97,59.37) v2(12.97,58.57) v2(12.97,57.77) v2(12.97,56.97) v2(12.97,56.17) v2(12.97,55.37) v2(12.97,54.57) v2(12.97,53.77) v2(12.97,52.97) v2(13.77,64.97) v2(13.77,64.17) v2(13.77,63.37) v2(13.77,62.57) v2(13.77,61.77) v2(13.77,60.97) v2(13.77,60.17) v2(13.77,59.37) v2(13.77,58.57) v2(13.77,57.77) v2(13.77,56.97) v2(13.77,56.17) v2(13.77,55.37) v2(13.77,54.57) v2(13.77,53.77) v2(13.77,52.97) v2(14.57,64.97) v2(14.57,64.17) v2(14.57,63.37) v2(14.57,62.57) v2(14.57,61.77) v2(14.57,60.97) v2(14.57,60.17) v2(14.57,59.37) v2(14.57,58.57) v2(14.57,57.77) v2(14.57,56.97) v2(14.57,56.17) v2(14.57,55.37) v2(14.57,54.57) v2(14.57,53.77) v2(14.57,52.97) v2(15.37,64.97) v2(15.37,64.17) v2(15.37,63.37) v2(15.37,62.57) v2(15.37,61.77) v2(15.37,60.97) v2(15.37,60.17) v2(15.37,59.37) v2(15.37,58.57) v2(15.37,57.77) v2(15.37,56.97) v2(15.37,56.17) v2(15.37,55.37) v2(15.37,54.57) v2(15.37,53.77) v2(15.37,52.97) v2(16.17,64.97) v2(16.17,64.17) v2(16.17,63.37) v2(16.17,62.57) v2(16.17,61.77) v2(16.17,60.97) v2(16.17,60.17) v2(16.17,59.37) v2(16.17,58.57) v2(16.17,57.77) v2(16.17,56.97) v2(16.17,56.17) v2(16.17,55.37) v2(16.17,54.57) v2(16.17,53.77) v2(16.17,52.97) v2(16.97,64.97) v2(16.97,64.17) v2(16.97,63.37) v2(16.97,62.57) v2(16.97,61.77) v2(16.97,60.97) v2(16.97,60.17) v2(16.97,59.37) v2(16.97,58.57) v2(16.97,57.77) v2(16.97,56.97) v2(16.97,56.17) v2(16.97,55.37) v2(16.97,54.57) v2(16.97,53.77) v2(16.97,52.97) v2(17.77,64.97) v2(17.77,64.17) v2(17.77,60.97) v2(17.77,60.17) v2(17.77,59.37) v2(17.77,58.57) v2(17.77,57.77) v2(17.77,56.97) v2(17.77,56.17) v2(17.77,55.37) v2(17.77,54.57) v2(17.77,53.77) v2(17.77,52.97) v2(18.57,64.97) v2(18.57,64.17) v2(18.57,60.17) v2(18.57,59.37) v2(18.57,58.57) v2(18.57,57.77) v2(18.57,56.97) v2(18.57,56.17) v2(18.57,55.37) v2(18.57,54.57) v2(18.57,53.77) v2(18.57,52.97) v2(19.37,64.97) v2(19.37,64.17) v2(19.37,60.17) v2(19.37,59.37) v2(19.37,58.57) v2(19.37,57.77) v2(19.37,56.97) v2(19.37,56.17) v2(19.37,55.37) v2(19.37,54.57) v2(19.37,53.77) v2(19.37,52.97) v2(20.17,64.97) v2(20.17,64.17) v2(20.17,63.37) v2(20.17,60.97) v2(20.17,60.17) v2(20.17,59.37) v2(20.17,58.57) v2(20.17,57.77) v2(20.17,56.97) v2(20.17,56.17) v2(20.17,55.37) v2(20.17,54.57) v2(20.17,53.77) v2(20.17,52.97) v2(20.97,64.97) v2(20.97,64.17) v2(20.97,63.37) v2(20.97,62.57) v2(20.97,61.77) v2(20.97,60.97) v2(20.97,60.17) v2(20.97,59.37) v2(20.97,58.57) v2(20.97,57.77) v2(20.97,56.97) v2(20.97,56.17) v2(20.97,55.37) v2(20.97,54.57) v2(20.97,53.77) v2(20.97,52.97) v2(21.77,64.97) v2(21.77,64.17) v2(21.77,63.37) v2(21.77,62.57) v2(21.77,61.77) v2(21.77,60.97) v2(21.77,60.17) v2(21.77,59.37) v2(21.77,58.57) v2(21.77,57.77) v2(21.77,56.97) v2(21.77,56.17) v2(21.77,55.37) v2(21.77,54.57) v2(21.77,53.77) v2(21.77,52.97) v2(22.57,64.97) v2(22.57,64.17) v2(22.57,63.37) v2(22.57,62.57) v2(22.57,61.77) v2(22.57,60.97) v2(22.57,60.17) v2(22.57,59.37) v2(22.57,58.57) v2(22.57,57.77) v2(22.57,56.97) v2(22.57,56.17) v2(22.57,55.37) v2(22.57,54.57) v2(22.57,53.77) v2(22.57,52.97) v2(23.37,64.97) v2(23.37,64.17) v2(23.37,63.37) v2(23.37,62.57) v2(23.37,61.77) v2(23.37,60.97) v2(23.37,60.17) v2(23.37,59.37) v2(23.37,58.57) v2(23.37,57.77) v2(23.37,56.97) v2(23.37,56.17) v2(23.37,55.37) v2(23.37,54.57) v2(23.37,53.77) v2(23.37,52.97) v2(24.17,64.97) v2(24.17,64.17) v2(24.17,63.37) v2(24.17,62.57) v2(24.17,61.77) v2(24.17,60.97) v2(24.17,60.17) v2(24.17,59.37) v2(24.17,58.57) v2(24.17,57.77) v2(24.17,56.97) v2(24.17,56.17) v2(24.17,55.37) v2(24.17,54.57) v2(24.17,53.77) v2(24.17,52.97) v2(24.97,64.97) v2(24.97,64.17) v2(24.97,63.37) v2(24.97,62.57) v2(24.97,61.77) v2(24.97,60.97) v2(24.97,60.17) v2(24.97,59.37) v2(24.97,58.57) v2(24.97,57.77) v2(24.97,56.97) v2(24.97,56.17) v2(24.97,55.37) v2(24.97,54.57) v2(24.97,53.77) v2(24.97,52.97) v2(25.77,64.97) v2(25.77,64.17) v2(25.77,63.37) v2(25.77,62.57) v2(25.77,61.77) v2(25.77,60.97) v2(25.77,60.17) v2(25.77,59.37) v2(25.77,58.57) v2(25.77,57.77) v2(25.77,56.97) v2(25.77,56.17) v2(25.77,55.37) v2(25.77,54.57) v2(25.77,53.77) v2(25.77,52.97) v2(26.57,64.97) v2(26.57,64.17) v2(26.57,63.37) v2(26.57,62.57) v2(26.57,61.77) v2(26.57,60.97) v2(26.57,60.17) v2(26.57,59.37) v2(26.57,58.57) v2(26.57,57.77) v2(26.57,56.97) v2(26.57,56.17) v2(26.57,55.37) v2(26.57,54.57) v2(26.57,53.77) v2(26.57,52.97) v2(27.37,64.97) v2(27.37,64.17) v2(27.37,63.37) v2(27.37,62.57) v2(27.37,61.77) v2(27.37,60.97) v2(27.37,60.17) v2(27.37,59.37) v2(27.37,58.57) v2(27.37,57.77) v2(27.37,56.97) v2(27.37,56.17) v2(27.37,55.37) v2(27.37,54.57) v2(27.37,53.77) v2(27.37,52.97) v2(28.17,64.97) v2(28.97,64.97) v2(29.77,64.97) v2(30.57,64.97) v2(31.37,64.97) v2(32.17,64.97) v2(32.97,64.97) v2(33.77,64.97) v2(34.57,64.97) v2(35.37,64.97) v2(36.17,64.97) v2(36.97,64.97)
$1N1759:
  vias: v2(7.4,81.8) v2(7.4,81) v2(7.4,80.2) v2(7.4,79.4) v2(7.4,78.6) v2(7.4,77.8) v2(7.4,77) v2(7.4,76.2) v2(7.4,75.4) v2(7.4,74.6) v2(7.4,71.4) v2(7.4,70.6) v2(7.4,69.8) v2(8.2,81.8) v2(8.2,81) v2(8.2,80.2) v2(8.2,79.4) v2(8.2,78.6) v2(8.2,77.8) v2(8.2,77) v2(8.2,76.2) v2(8.2,75.4) v2(8.2,74.6) v2(8.2,70.6) v2(8.2,69.8) v2(9,81.8) v2(9,81) v2(9,80.2) v2(9,79.4) v2(9,78.6) v2(9,77.8) v2(9,77) v2(9,76.2) v2(9,75.4) v2(9,74.6) v2(9,70.6) v2(9,69.8) v2(9.8,81.8) v2(9.8,81) v2(9.8,80.2) v2(9.8,79.4) v2(9.8,78.6) v2(9.8,77.8) v2(9.8,77) v2(9.8,76.2) v2(9.8,75.4) v2(9.8,74.6) v2(9.8,71.4) v2(9.8,70.6) v2(9.8,69.8) v2(10.6,81.8) v2(10.6,81) v2(10.6,80.2) v2(10.6,79.4) v2(10.6,78.6) v2(10.6,77.8) v2(10.6,77) v2(10.6,76.2) v2(10.6,75.4) v2(10.6,74.6) v2(10.6,73.8) v2(10.6,73) v2(10.6,72.2) v2(10.6,71.4) v2(10.6,70.6) v2(10.6,69.8) v2(11.4,81.8) v2(11.4,81) v2(11.4,80.2) v2(11.4,79.4) v2(11.4,78.6) v2(11.4,77.8) v2(11.4,77) v2(11.4,76.2) v2(11.4,75.4) v2(11.4,74.6) v2(11.4,73.8) v2(11.4,73) v2(11.4,72.2) v2(11.4,71.4) v2(11.4,70.6) v2(11.4,69.8) v2(12.2,81.8) v2(12.2,81) v2(12.2,80.2) v2(12.2,79.4) v2(12.2,78.6) v2(12.2,77.8) v2(12.2,77) v2(12.2,76.2) v2(12.2,75.4) v2(12.2,74.6) v2(12.2,73.8) v2(12.2,73) v2(12.2,72.2) v2(12.2,71.4) v2(12.2,70.6) v2(12.2,69.8) v2(13,81.8) v2(13,81) v2(13,80.2) v2(13,79.4) v2(13,78.6) v2(13,77.8) v2(13,77) v2(13,76.2) v2(13,75.4) v2(13,74.6) v2(13,73.8) v2(13,73) v2(13,72.2) v2(13,71.4) v2(13,70.6) v2(13,69.8) v2(13.8,81.8) v2(13.8,81) v2(13.8,80.2) v2(13.8,79.4) v2(13.8,78.6) v2(13.8,77.8) v2(13.8,77) v2(13.8,76.2) v2(13.8,75.4) v2(13.8,74.6) v2(13.8,73.8) v2(13.8,73) v2(13.8,72.2) v2(13.8,71.4) v2(13.8,70.6) v2(13.8,69.8) v2(14.6,81.8) v2(14.6,81) v2(14.6,80.2) v2(14.6,79.4) v2(14.6,78.6) v2(14.6,77.8) v2(14.6,77) v2(14.6,76.2) v2(14.6,75.4) v2(14.6,74.6) v2(14.6,73.8) v2(14.6,73) v2(14.6,72.2) v2(14.6,71.4) v2(14.6,70.6) v2(14.6,69.8) v2(15.4,81.8) v2(15.4,81) v2(15.4,80.2) v2(15.4,79.4) v2(15.4,78.6) v2(15.4,77.8) v2(15.4,77) v2(15.4,76.2) v2(15.4,75.4) v2(15.4,74.6) v2(15.4,73.8) v2(15.4,73) v2(15.4,72.2) v2(15.4,71.4) v2(15.4,70.6) v2(15.4,69.8) v2(16.2,81.8) v2(16.2,81) v2(16.2,80.2) v2(16.2,79.4) v2(16.2,78.6) v2(16.2,77.8) v2(16.2,77) v2(16.2,76.2) v2(16.2,75.4) v2(16.2,74.6) v2(16.2,73.8) v2(16.2,73) v2(16.2,72.2) v2(16.2,71.4) v2(16.2,70.6) v2(16.2,69.8) v2(17,81.8) v2(17,81) v2(17,80.2) v2(17,79.4) v2(17,78.6) v2(17,77.8) v2(17,77) v2(17,76.2) v2(17,75.4) v2(17,74.6) v2(17,73.8) v2(17,73) v2(17,72.2) v2(17,71.4) v2(17,70.6) v2(17,69.8) v2(17.8,81.8) v2(17.8,81) v2(17.8,80.2) v2(17.8,79.4) v2(17.8,78.6) v2(17.8,77.8) v2(17.8,77) v2(17.8,76.2) v2(17.8,75.4) v2(17.8,74.6) v2(17.8,71.4) v2(17.8,70.6) v2(17.8,69.8) v2(18.6,81.8) v2(18.6,81) v2(18.6,80.2) v2(18.6,79.4) v2(18.6,78.6) v2(18.6,77.8) v2(18.6,77) v2(18.6,76.2) v2(18.6,75.4) v2(18.6,74.6) v2(18.6,70.6) v2(18.6,69.8) v2(19.4,81.8) v2(19.4,81) v2(19.4,80.2) v2(19.4,79.4) v2(19.4,78.6) v2(19.4,77.8) v2(19.4,77) v2(19.4,76.2) v2(19.4,75.4) v2(19.4,74.6) v2(19.4,70.6) v2(19.4,69.8) v2(20.2,81.8) v2(20.2,81) v2(20.2,80.2) v2(20.2,79.4) v2(20.2,78.6) v2(20.2,77.8) v2(20.2,77) v2(20.2,76.2) v2(20.2,75.4) v2(20.2,74.6) v2(20.2,73.8) v2(20.2,71.4) v2(20.2,70.6) v2(20.2,69.8) v2(21,81.8) v2(21,81) v2(21,80.2) v2(21,79.4) v2(21,78.6) v2(21,77.8) v2(21,77) v2(21,76.2) v2(21,75.4) v2(21,74.6) v2(21,73.8) v2(21,73) v2(21,72.2) v2(21,71.4) v2(21,70.6) v2(21,69.8) v2(21.8,81.8) v2(21.8,81) v2(21.8,80.2) v2(21.8,79.4) v2(21.8,78.6) v2(21.8,77.8) v2(21.8,77) v2(21.8,76.2) v2(21.8,75.4) v2(21.8,74.6) v2(21.8,73.8) v2(21.8,73) v2(21.8,72.2) v2(21.8,71.4) v2(21.8,70.6) v2(21.8,69.8) v2(22.6,81.8) v2(22.6,81) v2(22.6,80.2) v2(22.6,79.4) v2(22.6,78.6) v2(22.6,77.8) v2(22.6,77) v2(22.6,76.2) v2(22.6,75.4) v2(22.6,74.6) v2(22.6,73.8) v2(22.6,73) v2(22.6,72.2) v2(22.6,71.4) v2(22.6,70.6) v2(22.6,69.8) v2(23.4,81.8) v2(23.4,81) v2(23.4,80.2) v2(23.4,79.4) v2(23.4,78.6) v2(23.4,77.8) v2(23.4,77) v2(23.4,76.2) v2(23.4,75.4) v2(23.4,74.6) v2(23.4,73.8) v2(23.4,73) v2(23.4,72.2) v2(23.4,71.4) v2(23.4,70.6) v2(23.4,69.8) v2(24.2,81.8) v2(24.2,81) v2(24.2,80.2) v2(24.2,79.4) v2(24.2,78.6) v2(24.2,77.8) v2(24.2,77) v2(24.2,76.2) v2(24.2,75.4) v2(24.2,74.6) v2(24.2,73.8) v2(24.2,73) v2(24.2,72.2) v2(24.2,71.4) v2(24.2,70.6) v2(24.2,69.8) v2(25,81.8) v2(25,81) v2(25,80.2) v2(25,79.4) v2(25,78.6) v2(25,77.8) v2(25,77) v2(25,76.2) v2(25,75.4) v2(25,74.6) v2(25,73.8) v2(25,73) v2(25,72.2) v2(25,71.4) v2(25,70.6) v2(25,69.8) v2(25.8,81.8) v2(25.8,81) v2(25.8,80.2) v2(25.8,79.4) v2(25.8,78.6) v2(25.8,77.8) v2(25.8,77) v2(25.8,76.2) v2(25.8,75.4) v2(25.8,74.6) v2(25.8,73.8) v2(25.8,73) v2(25.8,72.2) v2(25.8,71.4) v2(25.8,70.6) v2(25.8,69.8) v2(26.6,81.8) v2(26.6,81) v2(26.6,80.2) v2(26.6,79.4) v2(26.6,78.6) v2(26.6,77.8) v2(26.6,77) v2(26.6,76.2) v2(26.6,75.4) v2(26.6,74.6) v2(26.6,73.8) v2(26.6,73) v2(26.6,72.2) v2(26.6,71.4) v2(26.6,70.6) v2(26.6,69.8) v2(27.4,81.8) v2(27.4,81) v2(27.4,80.2) v2(27.4,79.4) v2(27.4,78.6) v2(27.4,77.8) v2(27.4,77) v2(27.4,76.2) v2(27.4,75.4) v2(27.4,74.6) v2(27.4,73.8) v2(27.4,73) v2(27.4,72.2) v2(27.4,71.4) v2(27.4,70.6) v2(27.4,69.8) v2(28.2,69.8) v2(29,69.8) v2(29.8,69.8) v2(30.6,69.8) v2(31.4,69.8) v2(32.2,69.8) v2(33,69.8) v2(33.8,69.8) v2(34.6,69.8) v2(35.4,69.8) v2(36.2,69.8) v2(37,69.8)
$1N2377:
  vias: v2(45.19,80.62) v2(45.19,79.82) v2(45.19,79.02) v2(45.19,78.22) v2(45.19,77.42) v2(45.19,76.62) v2(45.19,75.82) v2(45.19,61.42) v2(45.19,60.62) v2(45.19,59.82) v2(45.19,59.02) v2(45.19,58.22) v2(45.19,57.42) v2(45.99,80.62) v2(45.99,79.82) v2(45.99,79.02) v2(45.99,78.22) v2(45.99,77.42) v2(45.99,76.62) v2(45.99,75.82) v2(45.99,61.42) v2(45.99,60.62) v2(45.99,59.82) v2(45.99,59.02) v2(45.99,58.22) v2(45.99,57.42) v2(46.79,80.62) v2(46.79,79.82) v2(46.79,79.02) v2(46.79,78.22) v2(46.79,77.42) v2(46.79,76.62) v2(46.79,75.82) v2(46.79,75.02) v2(46.79,74.22) v2(46.79,73.42) v2(46.79,72.62) v2(46.79,71.82) v2(46.79,71.02) v2(46.79,70.22) v2(46.79,69.42) v2(46.79,68.62) v2(46.79,67.82) v2(46.79,67.02) v2(46.79,66.22) v2(46.79,65.42) v2(46.79,64.62) v2(46.79,63.82) v2(46.79,63.02) v2(46.79,62.22) v2(46.79,61.42) v2(46.79,60.62) v2(46.79,59.82) v2(46.79,59.02) v2(46.79,58.22) v2(46.79,57.42) v2(47.59,80.62) v2(47.59,79.82) v2(47.59,79.02) v2(47.59,78.22) v2(47.59,77.42) v2(47.59,76.62) v2(47.59,75.82) v2(47.59,75.02) v2(47.59,74.22) v2(47.59,73.42) v2(47.59,72.62) v2(47.59,71.82) v2(47.59,71.02) v2(47.59,70.22) v2(47.59,69.42) v2(47.59,68.62) v2(47.59,67.82) v2(47.59,67.02) v2(47.59,66.22) v2(47.59,65.42) v2(47.59,64.62) v2(47.59,63.82) v2(47.59,63.02) v2(47.59,62.22) v2(47.59,61.42) v2(47.59,60.62) v2(47.59,59.82) v2(47.59,59.02) v2(47.59,58.22) v2(47.59,57.42) v2(48.39,80.62) v2(48.39,79.82) v2(48.39,79.02) v2(48.39,78.22) v2(48.39,77.42) v2(48.39,76.62) v2(48.39,75.82) v2(48.39,75.02) v2(48.39,74.22) v2(48.39,73.42) v2(48.39,72.62) v2(48.39,71.82) v2(48.39,71.02) v2(48.39,70.22) v2(48.39,69.42) v2(48.39,68.62) v2(48.39,67.82) v2(48.39,67.02) v2(48.39,66.22) v2(48.39,65.42) v2(48.39,64.62) v2(48.39,63.82) v2(48.39,63.02) v2(48.39,62.22) v2(48.39,61.42) v2(48.39,60.62) v2(48.39,59.82) v2(48.39,59.02) v2(48.39,58.22) v2(48.39,57.42) v2(49.19,80.62) v2(49.19,79.82) v2(49.19,79.02) v2(49.19,78.22) v2(49.19,77.42) v2(49.19,76.62) v2(49.19,75.82) v2(49.19,75.02) v2(49.19,74.22) v2(49.19,73.42) v2(49.19,72.62) v2(49.19,71.82) v2(49.19,71.02) v2(49.19,70.22) v2(49.19,69.42) v2(49.19,68.62) v2(49.19,67.82) v2(49.19,67.02) v2(49.19,66.22) v2(49.19,65.42) v2(49.19,64.62) v2(49.19,63.82) v2(49.19,63.02) v2(49.19,62.22) v2(49.19,61.42) v2(49.19,60.62) v2(49.19,59.82) v2(49.19,59.02) v2(49.19,58.22) v2(49.19,57.42) v2(49.99,80.62) v2(49.99,79.82) v2(49.99,79.02) v2(49.99,78.22) v2(49.99,77.42) v2(49.99,76.62) v2(49.99,75.82) v2(49.99,75.02) v2(49.99,74.22) v2(49.99,73.42) v2(49.99,72.62) v2(49.99,71.82) v2(49.99,71.02) v2(49.99,70.22) v2(49.99,69.42) v2(49.99,68.62) v2(49.99,67.82) v2(49.99,67.02) v2(49.99,66.22) v2(49.99,65.42) v2(49.99,64.62) v2(49.99,63.82) v2(49.99,63.02) v2(49.99,62.22) v2(49.99,61.42) v2(49.99,60.62) v2(49.99,59.82) v2(49.99,59.02) v2(49.99,58.22) v2(49.99,57.42) v2(50.79,80.62) v2(50.79,79.82) v2(50.79,79.02) v2(50.79,78.22) v2(50.79,77.42) v2(50.79,76.62) v2(50.79,75.82) v2(50.79,75.02) v2(50.79,74.22) v2(50.79,73.42) v2(50.79,72.62) v2(50.79,71.82) v2(50.79,71.02) v2(50.79,70.22) v2(50.79,69.42) v2(50.79,68.62) v2(50.79,67.82) v2(50.79,67.02) v2(50.79,66.22) v2(50.79,65.42) v2(50.79,64.62) v2(50.79,63.82) v2(50.79,63.02) v2(50.79,62.22) v2(50.79,61.42) v2(50.79,60.62) v2(50.79,59.82) v2(50.79,59.02) v2(50.79,58.22) v2(50.79,57.42) v2(51.59,80.62) v2(51.59,79.82) v2(51.59,79.02) v2(51.59,78.22) v2(51.59,77.42) v2(51.59,76.62) v2(51.59,75.82) v2(51.59,75.02) v2(51.59,74.22) v2(51.59,73.42) v2(51.59,72.62) v2(51.59,71.82) v2(51.59,71.02) v2(51.59,70.22) v2(51.59,69.42) v2(51.59,68.62) v2(51.59,67.82) v2(51.59,67.02) v2(51.59,66.22) v2(51.59,65.42) v2(51.59,64.62) v2(51.59,63.82) v2(51.59,63.02) v2(51.59,62.22) v2(51.59,61.42) v2(51.59,60.62) v2(51.59,59.82) v2(51.59,59.02) v2(51.59,58.22) v2(51.59,57.42)
$1N3140: length 2.2
  Top Layer w0.5: Q3.1 58.86,94.44 R199.1

## Copper pours and planes (outline as drawn; the poured copper is in the pictures)
GND on Top Layer: 150.02,0 150.04,100.17 24.62,100.17 24.45,100 24.45,88.27 61.98,88.27 71.88,78.36 71.88,0
$1N591 on Top Layer: 41.08,21.03 41.08,27 45.78,27 45.78,39.7 41.08,39.7 41.08,45.67 52.01,45.67 52.01,21.03
$1N591 on Bottom Layer: 41.02,20.97 41.02,26.94 45.72,26.94 45.72,39.64 41.02,39.64 41.02,45.73 52.07,45.73 52.07,20.97
$1N1634 on Top Layer: 6.5,30.66 37.5,30.66 37.5,16.66 6.5,16.66
$1N1634 on Bottom Layer: 6.5,30.66 37.5,30.66 37.5,16.66 6.5,16.66
$1N1649 on Top Layer: 6.5,47.49 37.5,47.49 37.5,33.49 6.5,33.49
$1N1649 on Bottom Layer: 6.5,47.54 37.5,47.54 37.5,33.54 6.5,33.54
$1N1712 on Top Layer: 6.47,66.07 37.47,66.07 37.47,52.07 6.47,52.07
$1N1712 on Bottom Layer: 6.5,66.04 37.5,66.04 37.5,52.04 6.5,52.04
$1N1759 on Top Layer: 6.5,82.9 37.5,82.9 37.5,68.9 6.5,68.9
$1N1759 on Bottom Layer: 6.5,82.93 37.5,82.93 37.5,68.93 6.5,68.93
$1N2377 on Top Layer: 41.08,56.52 41.08,62.48 45.78,62.48 45.78,75.18 41.08,75.18 41.08,81.15 52.13,81.15 52.13,56.52
$1N2377 on Bottom Layer: 41.08,56.52 41.08,62.48 45.78,62.48 45.78,75.18 41.08,75.18 41.08,81.15 52.13,81.15 52.13,56.52
